# Altium schematic sheet OPLink Mini.SchDoc: OPLink Mini
size A4; Author: D. Ankers; CompanyName: The OpenPilot Project; DrawnBy: D. Ankers; Engineer: D. Ankers; Organization: The OpenPilot Project; DocumentNumber: 1; Revision: A; SheetNumber: 1; SheetTotal: 1; License: Creative Commons BY NC SA; DocumentName: OPLink Mini; ProjectName: OPLink Mini
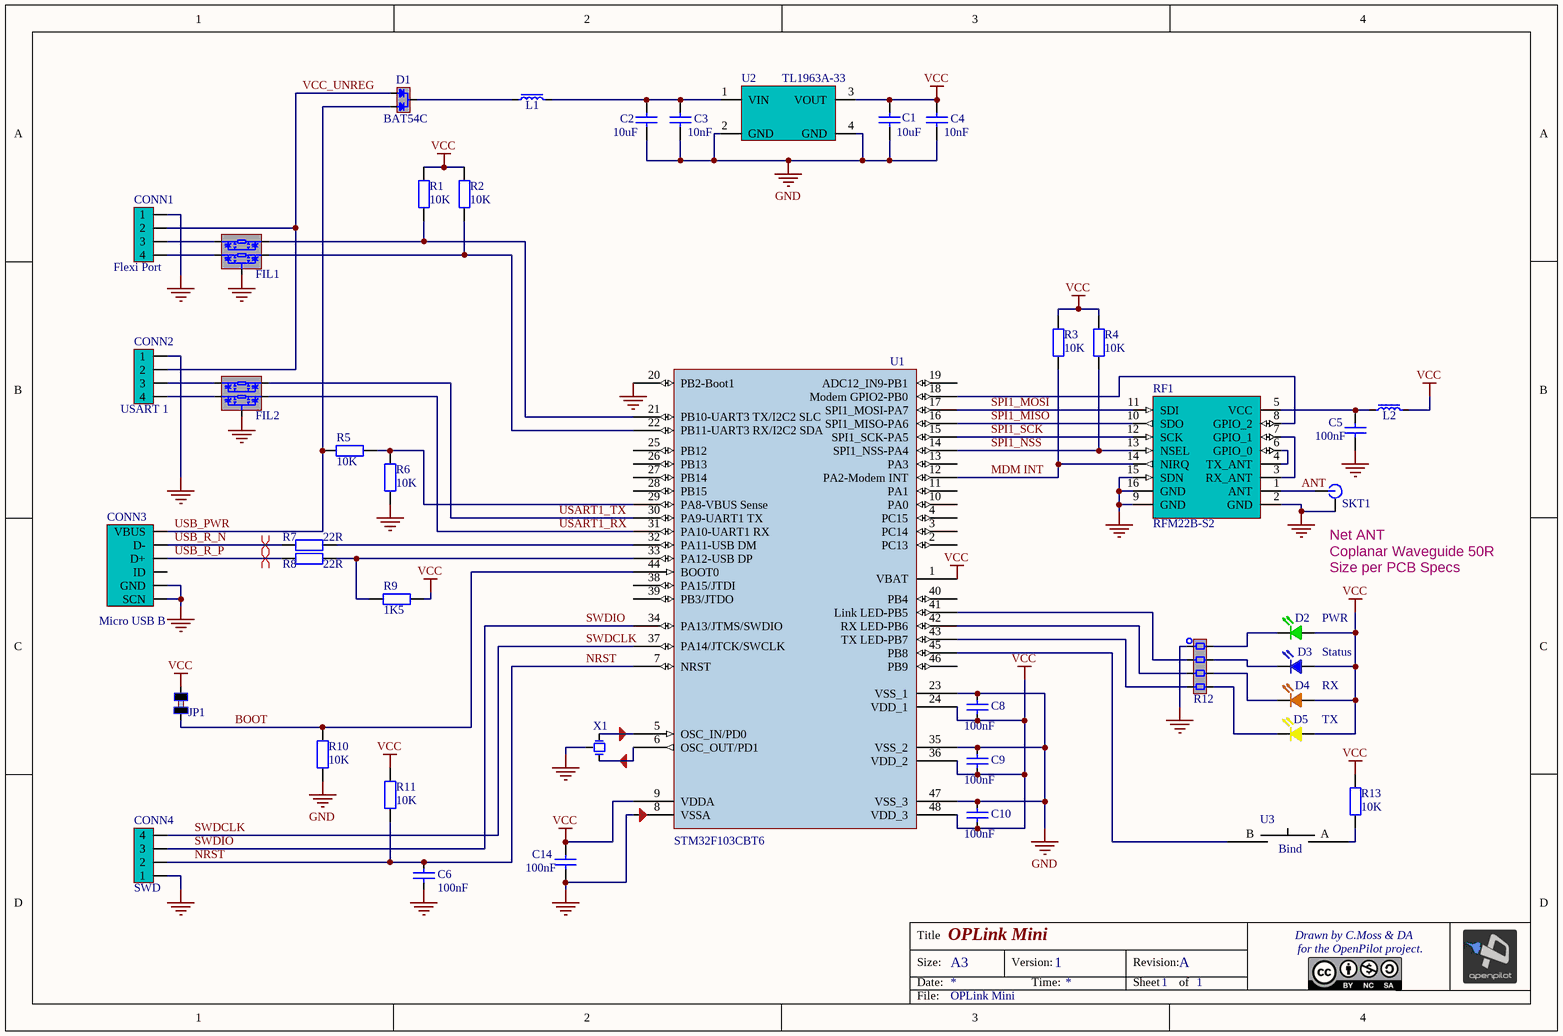
[diagram p0: OPLink Mini.SchDoc]

## Parts
C1  value 10uF  [CAP805L]  (hidden comment: Cap805)
C2  value 10uF  [CAP805L]  (hidden comment: Cap805)
C3  value 10nF  [CAP402N]  (hidden comment: 10n)
C4  value 10nF  [CAP402N]  (hidden comment: 10n)
C5  value 100nF  [CAP402N]  (hidden comment: Cap402)
C6  value 100nF  [CAP402N]  (hidden comment: Cap402)
C8  value 100nF  [CAP402N]  (hidden comment: Cap402)
C9  value 100nF  [CAP402N]  (hidden comment: Cap402)
C10  value 100nF  [CAP402N]  (hidden comment: Cap402)
C14  value 100nF  [CAP402N]  (hidden comment: Cap402)
CONN1  Flexi Port  [JST SH 4 Pin Side Entry]
CONN2  USART 1  [JST SH 4 Pin Side Entry]
CONN3  Micro USB B  [Micro_USB]
CONN4  SWD  [JST SH 4 Pin Side Entry]
D1  BAT54C  [SOT23-3N]
D2  PWR  [LED603N]
D3  Status  [LED603N]
D4  RX  [LED603N]
D5  TX  [LED603N]
FIL1  IP4256CZ5-W,115  [SOT-665]  (value not drawn)
FIL2  IP4256CZ5-W,115  [SOT-665]  (value not drawn)
JP1  2 PAD Touch JMP  [TOUCH JMP 2PAD]  (value not drawn)
L1  300mA  [IND603N]  (value not drawn)
L2  300mA  [IND603N]  (value not drawn)
R1  value 10K  [RES402N]  (hidden comment: Res402)
R2  value 10K  [RES402N]  (hidden comment: Res402)
R3  value 10K  [RES402N]  (hidden comment: Res402)
R4  value 10K  [RES402N]  (hidden comment: Res402)
R5  value 10K  [RES402N]  (hidden comment: Res402)
R6  value 10K  [RES402N]  (hidden comment: Res402)
R7  value 22R  [RES402N]  (hidden comment: Res402)
R8  value 22R  [RES402N]  (hidden comment: Res402)
R9  value 1K5  [RES402N]  (hidden comment: Res402)
R10  value 10K  [RES402N]  (hidden comment: Res402)
R11  value 10K  [RES402N]  (hidden comment: Res402)
R12  Res Array 330R 1206  [TC164]  (value not drawn)
R13  value 10K  [RES402N]  (hidden comment: Res402)
RF1  RFM22B-S2  [RFM22-S2]
SKT1  MMCX Thru hole  [MMCX_SOCKET]  (value not drawn)
U1  STM32F103CBT6  [STM32 48 Lead]
U2  TL1963A-33  [SOT223]
U3  Bind  [B3U-1000P]
X1  8Mhz Ceralock  [CERALOCK 8Mhz]  (value not drawn)

## Nets
GND: C1.2 C2.2 C3.2 C4.2 C5.2 C6.2 C8.1 C9.1 C10.1 C14.2 CONN1.1 CONN2.1 CONN3.0(SCN) CONN3.5(GND) CONN4.1 FIL1.2(PAD) FIL2.2(PAD) R6.2 R10.1 R12.1 RF1.2(GND) RF1.9(N.C) RF1.15(SDN) RF1.16(GND) SKT1.2(GND) U1.8(VSSA) U1.20(PB2-Boot1) U1.23(VSS_1) U1.35(VSS_2) U1.47(VSS_3) U2.2(GND) U2.4(GND) X1.3
VCC: C1.1 C4.1 C8.2 C9.2 C10.2 C14.1 D2.2(A) D3.2(A) D4.2(A) D5.2(A) JP1.2 L2.1 R1.1 R2.1 R3.1 R4.1 R9.2 R11.2 R13.2 U1.1(VBAT) U1.9(VDDA) U1.24(VDD_1) U1.36(VDD_2) U1.48(VDD_3) U2.3(VOUT)
ANT: RF1.1(N.C) SKT1.1(PIN)
BOOT: JP1.1 R10.2 U1.44(BOOT0)
MDM INT: R3.2 RF1.14(N.C) U1.12(PA2-Modem_INT)
NRST: C6.1 CONN4.2 R11.1 U1.7(NRST)
SPI1_MISO: RF1.10(SDO) U1.16(SPI1_MISO-PA6)
SPI1_MOSI: RF1.11(SDI) U1.17(SPI1_MOSI-PA7)
SPI1_NSS: R4.2 RF1.13(NSEL) U1.14(SPI1_NSS-PA4)
SPI1_SCK: RF1.12(SCK) U1.15(SPI1_SCK-PA5)
SWDCLK: CONN4.4 U1.37(PA14/JTCK/SWCLK)
SWDIO: CONN4.3 U1.34(PA13/JTMS/SWDIO)
USART1_RX: FIL2.1 U1.31(PA10-UART1_RX)
USART1_TX: FIL2.3 U1.30(PA9-UART1_TX)
USB_PWR: CONN3.1(VBUS) D1.2(A2) R5.2
USB_R_N: CONN3.2(D-) R7.2
USB_R_P: CONN3.3(D+) R8.2
VCC_UNREG: CONN1.2 CONN2.2 D1.1(A1)
NetC2_1: C2.1 C3.1 L1.1 U2.1(VIN)
NetC5_1: C5.1 L2.2 RF1.5(VCC)
NetCONN1_3: CONN1.3 FIL1.4
NetCONN1_4: CONN1.4 FIL1.5
NetCONN2_3: CONN2.3 FIL2.4
NetCONN2_4: CONN2.4 FIL2.5
NetD1_3: D1.3(COM) L1.2
NetD2_1: D2.1(K) R12.8
NetD3_1: D3.1(K) R12.7
NetD4_1: D4.1(K) R12.6
NetD5_1: D5.1(K) R12.5
NetFIL1_1: FIL1.1 R2.2 U1.22(PB11-UART3_RX/I2C2_SDA)
NetFIL1_3: FIL1.3 R1.2 U1.21(PB10-UART3_TX/I2C2_SLC)
NetR5_1: R5.1 R6.1 U1.29(PA8-VBUS_Sense)
NetR7_1: R7.1 U1.32(PA11-USB_DM)
NetR8_1: R8.1 R9.1 U1.33(PA12-USB_DP)
NetR12_2: R12.2 U1.41(Link_LED-PB5)
NetR12_3: R12.3 U1.42(RX_LED-PB6)
NetR12_4: R12.4 U1.43(TX_LED-PB7)
NetR13_1: R13.1 U3.A
NetRF1_3: RF1.3(RX_ANT) RF1.7(GPIO_1)
NetRF1_4: RF1.4(N.C) RF1.6(GPIO_0)
NetRF1_8: RF1.8(N.C) U1.18(Modem_GPIO2-PB0)
NetU1_5: U1.5(OSC_IN/PD0) X1.1
NetU1_6: U1.6(OSC_OUT/PD1) X1.2
NetU1_45: U1.45(PB8) U3.B

Not connected (* = marked no-connect by the designer): CONN3 4(ID); U1 2(PC13) 3(PC14) 4(PC15) 10(PA0) 11(PA1) 13(PA3) 19(ADC12_IN9-PB1) 25(PB12) 26(PB13) 27(PB14) 28(PB15) 38(PA15/JTDI) 39(PB3/JTDO) 40(PB4) 46(PB9)

## Layout directives
differential pair: USB_R_N, USB_R_P

## Notes on the sheet
- (near SKT1) Net ANT
  Coplanar Waveguide 50R
  Size per PCB Specs
- Title
- Size:
- Date:
- A3
- Version:
- Time:
- Revision:
- Sheet
- of
- Drawn by C.Moss & DA
- for the OpenPilot project.
- File:

## Library data of the parts
C1 C2 = Cap805: Capacitor SMD; Published: 1-Nov-2010; LatestRevisionDate: 1-Nov-2010; LatestRevisionNote: Released OpenPilot Lib; PackageReference: 0805 (2012 Metric); Publisher: The OpenPilot Project; Supplier 1: Digi-Key; Supplier Part Number 1: 490-3886-1-ND
C3-C6 C8-C10 C14 = Cap402: Capacitor SMD; Publisher: The OpenPilot Project; Published: 1-Nov-2010; LatestRevisionDate: 1-Nov-2010; LatestRevisionNote: Released OpenPilot Lib; PackageReference: 0402 (1005 Metric); ComponentLink2Description: Datasheet; Supplier 1: Digi-Key
  C3 C4: Supplier Part Number 1: 587-1223-1-ND
  C5 C6 C8-C10 C14: Supplier Part Number 1: 445-4952-1-ND
CONN1 CONN2 CONN4 = JST-SH 4-pin Side Entry Socket: Manufacturer: Generic Components; Class: Connector; Supplier 1: Digi-Key; Supplier Part Number 1: 455-1804-1-ND
CONN3 = USB Micro B SMT: USB Micro B SMT Socket; Class: Connector; ComponentLink2Description: Datasheet; LatestRevisionDate: 1-Nov-2010; LatestRevisionNote: Released OpenPilot Lib; Published: 1-Nov-2010; Publisher: The OpenPilot Project; Supplier 1: Digi-Key; Supplier Part Number 1: WM17141CT-ND
D1 = BAT54C: Dual Diode Command Cathode; Supplier 1: Digi-Key; Supplier Part Number 1: 497-3786-1-ND
D2 = LED 603 Gr: Green 603 LED; Value: 2.1v 20mA; Supplier 1: Digi-Key; Supplier Part Number 1: 754-1116-1-ND
D3 = LED 603 Bl: Blue 603 LED; Supplier 1: Digi-Key; Supplier Part Number 1: 350-2037-1-ND
D4 = LED 603 Or: Orange 603 LED; Value: 2.1v 20mA; Supplier 1: Digi-Key; Supplier Part Number 1: 754-1120-1-ND
D5 = LED 603 Yellow: Yellow 603 LED; Value: 2.1v 20mA; ComponentLink2Description: Datasheet; LatestRevisionDate: 1-Nov-2010; LatestRevisionNote: Released OpenPilot Lib; Published: 1-Nov-2010; Publisher: The OpenPilot Project; Supplier 1: Digi-Key; Supplier Part Number 1: 754-1125-1-ND
FIL1 FIL2 = RF Filter 100R 30pF: IP4256CZ5-W,115 2 channel, 100R, 30pF, RF ESD Filter; Manufacturer: Generic Components; Class: Passive; Supplier 1: Digi-Key; Supplier Part Number 1: 568-5871-1-ND; ComponentLink2Description: Datasheet; LatestRevisionDate: 1-Nov-2010; LatestRevisionNote: Released OpenPilot Lib; Published: 1-Nov-2010; Publisher: The OpenPilot Project
JP1 = 2 PAD Touch JMP: 2 Pad Touch Jumper; LatestRevisionDate: 1-Nov-2010; LatestRevisionNote: Released OpenPilot Lib; Published: 1-Nov-2010; Publisher: The OpenPilot Project
L1 L2 = FerriteBead_300mA: Ferrite Bead 300mA; Manufacturer: Generic Components; Class: Passive; Supplier 1: Digi-Key; Supplier Part Number 1: 587-1739-1-ND
R1-R11 R13 = Res402: Resistor SMD; Published: 1-Nov-2010; LatestRevisionDate: 1-Nov-2010; LatestRevisionNote: Released OpenPilot Lib; PackageReference: 0402 ( 1005 Metric); Publisher: The OpenPilot Project; ComponentLink2Description: Datasheet; Supplier 1: Digi-Key
  R1-R6 R10 R11 R13: Supplier Part Number 1: P10.0KLCT-ND
  R7 R8: Supplier Part Number 1: P22.0LCT-ND
  R9: Supplier Part Number 1: P1.50KLCT-ND
R12 = Res Array 330R: 4 Resistor Array; Class: Passive; SubClass: Resistor; Value: 330R; Supplier 1: Digi-Key; Supplier Part Number 1: TC164J-330CT-ND; ComponentLink2Description: Datasheet; LatestRevisionDate: 1-Nov-2010; LatestRevisionNote: Released OpenPilot Lib; Published: 1-Nov-2010; Publisher: The OpenPilot Project
RF1 = RFM22B-S2: UHF 100mW Transceiver
SKT1 = MMCX Thru hole: MMCX Socket; Supplier 1: Digi-Key; Supplier Part Number 1: ARF1729-ND
U1 = STM32F103CBT6: STM32 ARM-based 32-bit MCU with 128 Kbytes Flash, 48-pin LQFP, Industrial Temperature; Published: 30-May-2008; DatasheetVersion: rev6, Mar-2008; PackageVersion: Mar-2008; PackageReference: LQFP48; Publisher: Altium Limited; PackageDescription: 48-Pin Low-Profile Quad Flat Pack, 7 x 7 mm Body, 0.5 mm Pitch (LQFP48); ComponentLink1Description: Manufacturer Link; ComponentLink1URL: www.st.com/stm32; ComponentLink2Description: Datasheet; ComponentLink2URL: http://www.st.com/stonline/products/literature/ds/13587.pdf; Supplier 1: Digi-Key; Supplier Part Number 1: 497-6288-ND
U2 = TL1963A-33: 3.3V 1.5A LDO Regulator; ComponentLink2Description: Datasheet; LatestRevisionDate: 1-Nov-2010; LatestRevisionNote: Released OpenPilot Lib; Published: 1-Nov-2010; Publisher: The OpenPilot Project; Supplier 1: Digi-Key; Supplier Part Number 1: 296-24897-1-ND
U3 = Push Switch Small: Push Button SMD; Supplier 1: Digi-Key; Supplier Part Number 1: SW1020CT-ND
X1 = CERALOCK8: Ceralock 8Mhz with caps; Class: Oscillator; SubClass: Ceramic Oscillator; ComponentLink2Description: Datasheet; LatestRevisionDate: 1-Nov-2010; LatestRevisionNote: Released OpenPilot Lib; Published: 1-Nov-2010; Publisher: The OpenPilot Project; Supplier 1: Digi-Key; Supplier Part Number 1: 490-1195-1-ND